# Altium schematic sheet MCU.SchDoc: 02 MCU
size A3; Address1: Dệt May Huế; Address2: Nhà máy Sợi; Address3: Xuân Anh - Phước Sơn
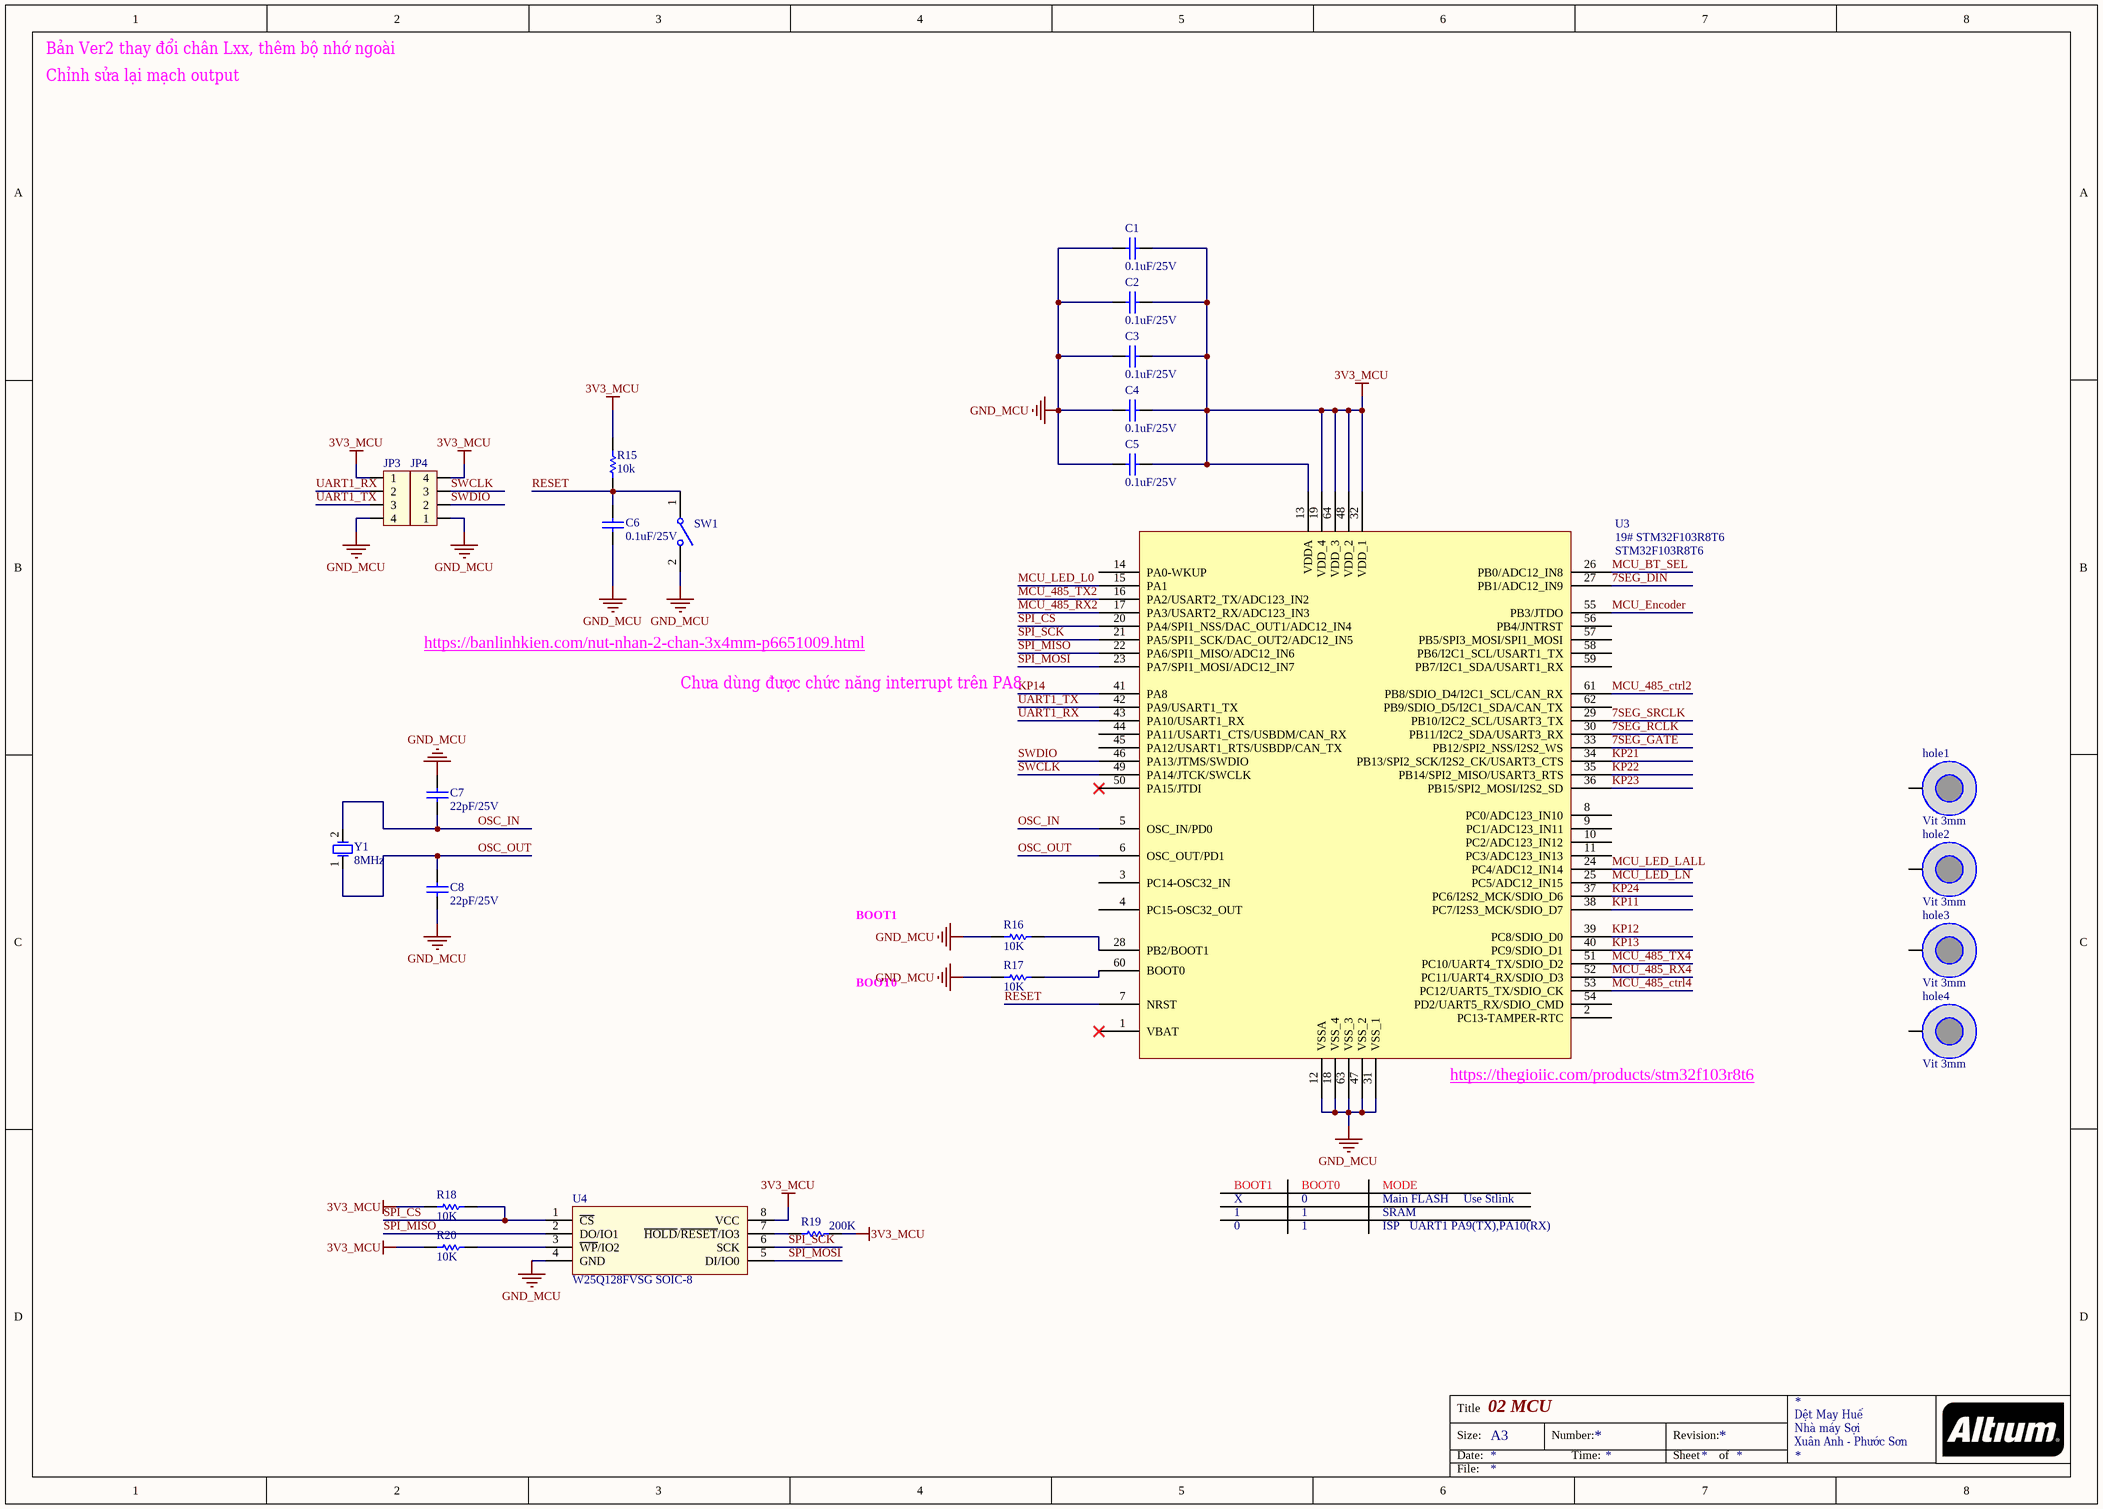
[diagram p0: MCU.SchDoc]

## Parts
C1  0.1uF/25V  [Cap Ceramic 0805 SMD]
C2  0.1uF/25V  [Cap Ceramic 0805 SMD]
C3  0.1uF/25V  [Cap Ceramic 0805 SMD]
C4  0.1uF/25V  [Cap Ceramic 0805 SMD]
C5  0.1uF/25V  [Cap Ceramic 0805 SMD]
C6  0.1uF/25V  [Cap Ceramic 0805 SMD]
C7  22pF/25V  [Cap Ceramic 0805 SMD]
C8  22pF/25V  [Cap Ceramic 0805 SMD]
hole1  Vit 3mm  [Screw 3 small]
hole2  Vit 3mm  [Screw 3 small]
hole3  Vit 3mm  [Screw 3 small]
hole4  Vit 3mm  [Screw 3 small]
JP3  PROGRAM  [Header_4]  (value not drawn)
JP4  PROGRAM  [Header_4]  (value not drawn)
R15  10k  [Res 0805 SMD]
R16  10K  [Res 0805 SMD]
R17  10K  [Res 0805 SMD]
R18  10K  [Res 0805 SMD]
R19  200K  [Res 0805 SMD]
R20  10K  [Res 0805 SMD]
SW1  3x4x2.5 2Pin SMD  [Button 3x4mm]  (value not drawn)
U3  19# STM32F103R8T6  Supplier Part Number 1: STM32F103R8T6  [19# STMF103R8T6]
U4  W25Q128FVSG SOIC-8  [1# W25Q128FV - 8SOIC 5.38mm]
Y1  8MHz  [CRYSTAL SMD]

## Nets
3V3_MCU: C1.2 C2.2 C3.2 C4.2 C5.2 JP3.1 JP4.4 R15.2 R18.2 R19.1 R20.1 U3.13(VDDA) U3.19(VDD_4) U3.32(VDD_1) U3.48(VDD_2) U3.64(VDD_3) U4.8(VCC)
GND_MCU: C1.1 C2.1 C3.1 C4.1 C5.1 C6.1 C7.1 C8.2 JP3.4 JP4.1 R16.2 R17.1 SW1.2(NO1) U3.12(VSSA) U3.18(VSS_4) U3.31(VSS_1) U3.47(VSS_2) U3.63(VSS_3) U4.4(GND)
7SEG_DIN: U3.27(PB1/ADC12_IN9)
7SEG_GATE: U3.33(PB12/SPI2_NSS/I2S2_WS)
7SEG_RCLK: U3.30(PB11/I2C2_SDA/USART3_RX)
7SEG_SRCLK: U3.29(PB10/I2C2_SCL/USART3_TX)
KP11: U3.38(PC7/I2S3_MCK/SDIO_D7)
KP12: U3.39(PC8/SDIO_D0)
KP13: U3.40(PC9/SDIO_D1)
KP14: U3.41(PA8)
KP21: U3.34(PB13/SPI2_SCK/I2S2_CK/USART3_CTS)
KP22: U3.35(PB14/SPI2_MISO/USART3_RTS)
KP23: U3.36(PB15/SPI2_MOSI/I2S2_SD)
KP24: U3.37(PC6/I2S2_MCK/SDIO_D6)
MCU_485_ctrl2: U3.61(PB8/SDIO_D4/I2C1_SCL/CAN_RX)
MCU_485_ctrl4: U3.53(PC12/UART5_TX/SDIO_CK)
MCU_485_RX2: U3.17(PA3/USART2_RX/ADC123_IN3)
MCU_485_RX4: U3.52(PC11/UART4_RX/SDIO_D3)
MCU_485_TX2: U3.16(PA2/USART2_TX/ADC123_IN2)
MCU_485_TX4: U3.51(PC10/UART4_TX/SDIO_D2)
MCU_BT_SEL: U3.26(PB0/ADC12_IN8)
MCU_Encoder: U3.55(PB3/JTDO)
MCU_LED_L0: U3.15(PA1)
MCU_LED_LALL: U3.24(PC4/ADC12_IN14)
MCU_LED_LN: U3.25(PC5/ADC12_IN15)
OSC_IN: C7.2 U3.5(OSC_IN/PD0) Y1.2(OSC2)
OSC_OUT: C8.1 U3.6(OSC_OUT/PD1) Y1.1(OSC1)
RESET: C6.2 R15.1 SW1.1(COMMON1) U3.7(NRST)
SPI_CS: R18.1 U3.20(PA4/SPI1_NSS/DAC_OUT1/ADC12_IN4) U4.1(~{CS})
SPI_MISO: U3.22(PA6/SPI1_MISO/ADC12_IN6) U4.2(DO/IO1)
SPI_MOSI: U3.23(PA7/SPI1_MOSI/ADC12_IN7) U4.5(DI/IO0)
SPI_SCK: U3.21(PA5/SPI1_SCK/DAC_OUT2/ADC12_IN5) U4.6(SCK)
SWCLK: JP4.3 U3.49(PA14/JTCK/SWCLK)
SWDIO: JP4.2 U3.46(PA13/JTMS/SWDIO)
UART1_RX: JP3.2 U3.43(PA10/USART1_RX)
UART1_TX: JP3.3 U3.42(PA9/USART1_TX)
NetR16_1: R16.1 U3.28(PB2/BOOT1)
NetR17_2: R17.2 U3.60(BOOT0)
NetR19_2: R19.2 U4.7(~{HOLD}/~{RESET}/IO3)
NetR20_2: R20.2 U4.3(~{WP}/IO2)

Not connected (* = marked no-connect by the designer): hole1 1(hole); hole2 1(hole); hole3 1(hole); hole4 1(hole); U3 1(VBAT)* 2(PC13-TAMPER-RTC) 3(PC14-OSC32_IN) 4(PC15-OSC32_OUT) 8(PC0/ADC123_IN10) 9(PC1/ADC123_IN11) 10(PC2/ADC123_IN12) 11(PC3/ADC123_IN13) 14(PA0-WKUP) 44(PA11/USART1_CTS/USBDM/CAN_RX) 45(PA12/USART1_RTS/USBDP/CAN_TX) 50(PA15/JTDI)* 54(PD2/UART5_RX/SDIO_CMD) 56(PB4/JNTRST) 57(PB5/SPI3_MOSI/SPI1_MOSI) 58(PB6/I2C1_SCL/USART1_TX) 59(PB7/I2C1_SDA/USART1_RX) 62(PB9/SDIO_D5/I2C1_SDA/CAN_TX)

## Notes on the sheet
- Bản Ver2 thay đổi chân Lxx, thêm bộ nhớ ngoài
- Chỉnh sửa lại mạch output
- https://banlinhkien.com/nut-nhan-2-chan-3x4mm-p6651009.html
- Chưa dùng được chức năng interrupt trên PA8
- BOOT1
- BOOT0
- (near U3) https://thegioiic.com/products/stm32f103r8t6
- MODE
- X
- 1
- 0
- Main FLASH
- SRAM
- ISP
- UART1 PA9(TX),PA10(RX)
- Use Stlink
- Title
- Size:
- Date:
- A3
- Number:
- Time:
- Revision:
- Sheet
- of
- File:

## Library data of the parts
C1-C6 = 0.1uF/25V/C0603/10%: CAP CER 0.1UF 25V 10% X7R 0603; Manufacturer: Murata Electronics North America; Manufacturer Part Number: GRM188R71E104KA01D; Capacitance: 0.1µF; RoHS: RoHS Compliant; Category: Capacitors; Packaging: Cut Tape (CT); Tolerance: ±10%; Voltage - Rated: 25V; Temperature Coefficient: X7R; Mounting Type: Surface Mount, MLCC; Operating Temperature: -55°C ~ 125°C; Applications: General Purpose; Ratings: -; Package / Case: 0603 (1608 Metric); Size / Dimension: 0.063" L x 0.031" W (1.60mm x 0.80mm); Height - Seated (Max): -; Thickness (Max): 0.035" (0.90mm); Lead Spacing: -; Features: -; Lead Style: -; ComponentLink1URL: http://www.murata.com/~/media/webrenewal/support/library/catalog/products/capacitor/mlcc/c02e.ashx; ComponentLink1Description: http://www.murata.com/~/media/webrenewal/support/library/catalog/products/capacitor/mlcc/c02e.ashx; Supplier 1: Digi-Key; Supplier Part Number 1: 490-1524-1-ND
C7 C8 = 22pF/50V/C0603/10%: CAP CER 22PF 50V NP0 0603; Manufacturer: Kemet; Manufacturer Part Number: C0603C220K5GACTU; Tolerance: ±10%; Temperature Coefficient: C0G, NP0; RoHS: RoHS Compliant; Category: Capacitors; Packaging: Digi-Reel®; Capacitance: 22pF; Voltage - Rated: 50V; Mounting Type: Surface Mount, MLCC; Operating Temperature: -55°C ~ 125°C; Applications: General Purpose; Ratings: -; Package / Case: 0603 (1608 Metric); Size / Dimension: 0.063" L x 0.031" W (1.60mm x 0.80mm); Height - Seated (Max): -; Thickness (Max): 0.034" (0.87mm); Lead Spacing: -; Features: -; Lead Style: -; ComponentLink1URL: http://www.kemet.com/docfinder?Partnumber=C0603C220K5GACTU; ComponentLink1Description: http://www.kemet.com/docfinder?Partnumber=C0603C220K5GACTU; Supplier 1: Digi-Key; Supplier Part Number 1: 399-7875-1-ND
JP3 JP4 = Con4: Connector 4; Value: Connector 4
R15-R18 R20 = 10K/R0603/1%: RES SMD 10K OHM 1% 1/10W 0603; Manufacturer: Yageo; Manufacturer Part Number: RC0603FR-0710KL; Power (Watts): 0.1W, 1/10W; Temperature Coefficient: ±100ppm/°C; Supplier 1: Digi-Key; RoHS: RoHS Compliant; Category: Resistors; Stock 1: 11440000; Pricing 1: 5000=0.00167, 10000=0.00145, 25000=0.00128, 50000=0.00117, 125000=0.00115 (USD); Packaging: Tape & Reel (TR); Resistance (Ohms): 10k; Tolerance: ±1%; Composition: Thick Film; Features: Moisture Resistant; Operating Temperature: -55°C ~ 155°C; Package / Case: 0603 (1608 Metric); Supplier Device Package: 0603; Size / Dimension: 0.063" L x 0.031" W (1.60mm x 0.80mm); Height: 0.022" (0.55mm); Number of Terminations: 2; ComponentLink1URL: http://www.yageo.com/NewPortal/yageodocoutput?fileName=/pdf/R-Chip/PYu-RC_Group_51_RoHS_L_3.pdf; ComponentLink1Description: http://www.yageo.com/NewPortal/yageodocoutput?fileName=/pdf/R-Chip/PYu-RC_Group_51_RoHS_L_3.pdf; Supplier Part Number 1: 311-10.0KHRTR-ND
  R15-R17: Buy Link: https://www.thegioiic.com/products?utf8=%E2%9C%93&search=%C4%91i%E1%BB%87n+tr%E1%BB%9F+0805
R19 = 200K/R0603/1%: RES SMD 200K OHM 1% 1/10W 0603; Manufacturer: Yageo; Manufacturer Part Number: RC0603FR-07200KL; Power (Watts): 0.1W, 1/10W; Temperature Coefficient: ±100ppm/°C; Supplier 1: Digi-Key; RoHS: RoHS Compliant; Category: Resistors; Stock 1: 924437; Pricing 1: 1=0.1, 10=0.015, 100=0.006, 1000=0.00268, 2500=0.00233 (USD); Packaging: Cut Tape (CT); Part Status: Active; Tolerance: ±1%; Composition: Thick Film; Features: Moisture Resistant; Operating Temperature: -55°C ~ 155°C; Package / Case: 0603 (1608 Metric); Supplier Device Package: 0603; Size / Dimension: 0.063" L x 0.031" W (1.60mm x 0.80mm); Height - Seated (Max): 0.022" (0.55mm); Failure Rate: -; ComponentLink1URL: http://www.yageo.com/documents/recent/PYu-RC_Group_51_RoHS_L_7.pdf; ComponentLink1Description: http://www.yageo.com/documents/recent/PYu-RC_Group_51_RoHS_L_7.pdf; Supplier Part Number 1: 311-200KHRCT-ND
SW1 = BUTTON 2-SMD RS-282G05A3: Manufacturer: C&K Components; Manufacturer Part Number: RS-282G05A3-SM RT; Circuit: SPST-NO; Switch Function: Off-Mom; Contact Rating @ Voltage: 0.05A @ 12VDC; Actuator Type: Rectangular Button; Actuator Height off PCB, from Pins: 2.50mm; Actuator Orientation: Top Actuated; Outline: 6.00mm x 3.60mm; Illumination: Non-Illuminated; Operating Force: 250gf; Actuator Material: Polyamide (PA), Nylon; Switch Travel: 0.25mm; Mechanical Life: 50,000 Cycles; RoHS: RoHS Compliant; Category: Switches; Packaging: Cut Tape (CT); Part Status: Active; Mounting Type: Surface Mount; Termination Style: Gull Wing; Illumination Voltage (Nominal): -; Illumination Type, Color: -; Ingress Protection: -; Features: -; Operating Temperature: -; ComponentLink1URL: http://media.digikey.com/pdf/Data%20Sheets/C&K/RS-282G05A-SM_RT.pdf; ComponentLink1Description: http://media.digikey.com/pdf/Data%20Sheets/C&K/RS-282G05A-SM_RT.pdf; Supplier 1: Digi-Key; Supplier Part Number 1: CKN10384CT-ND; Buy Link: https://thegioiic.com/products/nut-nhan-3x4x2-5-2pin-smd
U3 = 19# STM32F103R8T6: STM32 ARM-based 32-bit MCU with ARM 32-bit Cortex-M3 Microcontroller, 64 Kbytes Flash, 64-pin LQFP, Industrial Temperature; UART: 5; I2C: 2; SPI/I2S: 3; USB 2.0: 1; ARM Core: Cortex M3; Published: 30-May-2008; DatasheetVersion: rev6, Mar-2008; PackageVersion: Mar-2008; PackageReference: LQFP64; Publisher: Altium Limited; PackageDescription: 64-Pin Low-Profile Quad Flat Pack, 10 x 10 mm Body, 0.5 mm Pitch (LQFP64); ComponentLink1Description: Manufacturer Link; ComponentLink1URL: www.st.com/stm32; ComponentLink2Description: Datasheet; ComponentLink2URL: http://www.st.com/stonline/products/literature/ds/13587.pdf; CAN 2.0: 1; ADC: 3; DAC: 2; Case/Package: LQFP - 64; Supplier 1: Future Electronics; Buy Link: https://thegioiic.com/products/stm32f103r8t6
U4 = 1# W25Q128FVSG SOIC-8
Y1 = Crystal SMD FA-128 26MHz: 8MHz SMD; Value: 26MHz; ComponentLink1Description: Datasheet; ComponentLink1URL: D:\Dropbox\Datasheets\Passive Components\Crystals\HC49S.pdf; Unit Price: 0.0440